# EAGLE design SmartRock_EC (EAGLE 9.5.1)
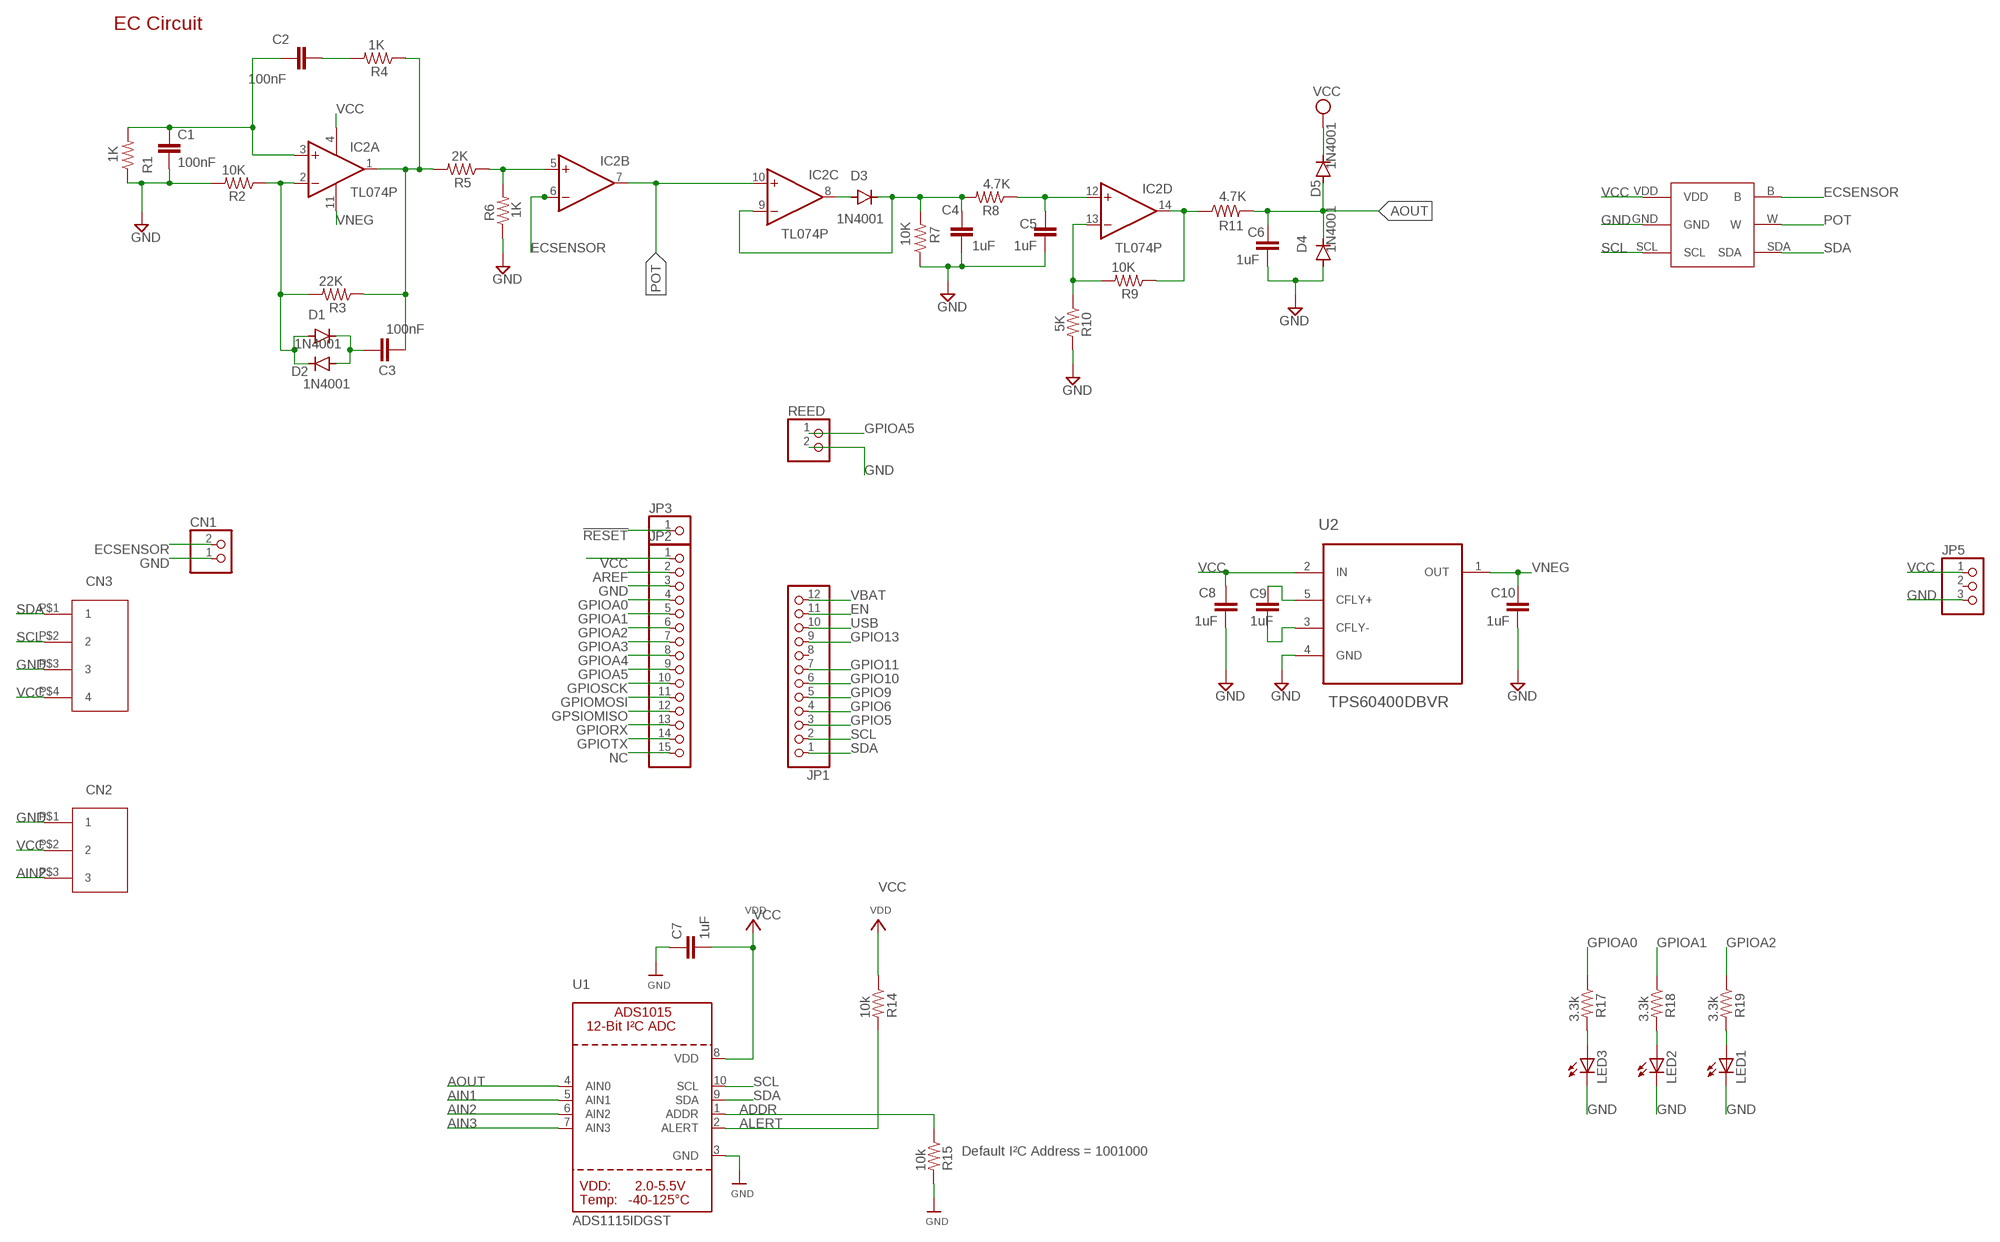
[diagram p0: schematic, sheet 1]

## Parts
C1  100nF  C-EUC1206  [C1206]
C2  100nF  C-EUC1206  [C1206]
C3  100nF  C-EUC1206  [C1206]
C4  1uF  C-EUC1206  [C1206]
C5  1uF  C-EUC1206  [C1206]
C6  1uF  C-EUC1206  [C1206]
C7  1uF  C-EUC1206  [C1206]
C8  1uF  C-EUC1206  [C1206]
C9  1uF  C-EUC1206  [C1206]
C10  1uF  C-EUC1206  [C1206]
CN1  JST_2PIN-THM  [JST-PH-2-THM]
D1  1N4001  DIODE-D-5  [D-5]
D2  1N4001  DIODE-D-5  [D-5]
D3  1N4001  DIODE-D-5  [D-5]
D4  1N4001  DIODE-D-5  [D-5]
D5  1N4001  DIODE-D-5  [D-5]
IC2  TL074P  [DIL14]
JP1  PINHD-1X12-CB  [1X12-CB]
JP2  PINHD-1X15-CB  [1X15-CB]
JP3  PINHD-1X1CB  [1X01-CLEANBIG]
JP5  PINHD-1X3CB  [1X03-CLEANBIG]
LED1  LEDSMT1206  [1206]
LED2  LEDSMT1206  [1206]
LED3  LEDSMT1206  [1206]
R1  1K  R-US_R1206  [R1206]
R2  10K  R-US_R1206  [R1206]
R3  22K  R-US_R1206  [R1206]
R4  1K  R-US_R1206  [R1206]
R5  2K  R-US_R1206  [R1206]
R6  1K  R-US_R1206  [R1206]
R7  10K  R-US_R1206  [R1206]
R8  4.7K  R-US_R1206  [R1206]
R9  10K  R-US_R1206  [R1206]
R10  5K  R-US_R1206  [R1206]
R11  4.7K  R-US_R1206  [R1206]
R14  10k  R-US_R1206  [R1206]
R15  10k  R-US_R1206  [R1206]
R17  3.3k  R-US_R1206  [R1206]
R18  3.3k  R-US_R1206  [R1206]
R19  3.3k  R-US_R1206  [R1206]
REED  PINHD-1X2  [1X02]
U1  ADS1115IDGST  ADC_ADS1015  [MSOP10]
U2  TPS60400DBVR  [SOT95P280X145-5N]
U$1  AD5246  [AD5246]
U$7  JST_4PIN_2MM  [JST_4PIN_2MM]
U$9  JST_3PIN_2MM  [JST_3PIN_2MM]

## Nets
!RESET: JP3.1
ADDR: R15.1 U1.1(ADDR)
AIN1: U1.5(AIN1)
AIN2: U1.6(AIN2) U$9.P$3
AIN3: U1.7(AIN3)
ALERT: R14.2 U1.2(ALERT)
AOUT: C6.2 D4.C D5.A R11.2 U1.4(AIN0)
AREF: JP2.2
ECSENSOR: CN1.2 IC2.6(B:-IN) U$1.B
EN: JP1.11
GND: C1.2 C4.1 C5.1 C6.1 C7.1 C8.1 C10.1 CN1.1 D4.A JP2.3 JP5.3 LED1.C LED2.C LED3.C R1.1 R2.2 R6.1 R7.1 R10.2 R15.2 REED.2 U1.3(GND) U2.4(GND) U$1.GND U$7.P$3 U$9.P$1
GPIO5: JP1.3
GPIO6: JP1.4
GPIO9: JP1.5
GPIO10: JP1.6
GPIO11: JP1.7
GPIO13: JP1.9
GPIOA0: JP2.4 R17.1
GPIOA1: JP2.5 R18.1
GPIOA2: JP2.6 R19.1
GPIOA3: JP2.7
GPIOA4: JP2.8
GPIOA5: JP2.9 REED.1
GPIOMOSI: JP2.11
GPIORX: JP2.13
GPIOSCK: JP2.10
GPIOTX: JP2.14
GPSIOMISO: JP2.12
N$1: C1.1 C2.1 IC2.3(A:+IN) R1.2
N$2: C2.2 R4.2
N$3: C3.2 IC2.1(A:OUT) R3.1 R4.1 R5.2
N$4: D1.A D2.C IC2.2(A:-IN) R2.1 R3.2
N$5: IC2.5(B:+IN) R5.1 R6.2
N$9: C3.1 D1.C D2.A
N$12: C4.2 D3.C IC2.9(C:-IN) R7.2 R8.2
N$13: D3.A IC2.8(C:OUT)
N$15: C5.2 IC2.12(D:+IN) R8.1
N$16: IC2.13(D:-IN) R9.2 R10.1
N$18: IC2.14(D:OUT) R9.1 R11.1
N$20: LED3.A R17.2
N$21: LED2.A R18.2
N$22: LED1.A R19.2
N$27: C9.2 U2.5(CFLY+)
N$28: C9.1 U2.3(CFLY-)
NC: JP2.15
POT: IC2.7(B:OUT) IC2.10(C:+IN) U$1.W
SCL: JP1.2 U1.10(SCL) U$1.SCL U$7.P$2
SDA: JP1.1 U1.9(SDA) U$1.SDA U$7.P$1
USB: JP1.10
VBAT: JP1.12
VCC: C7.2 C8.2 D5.C IC2.4(P:V+) JP2.1 JP5.1 R14.1 U1.8(VDD) U2.2(IN) U$1.VDD U$7.P$4 U$9.P$2 ; supply symbol labelled VDD
VNEG: C10.2 IC2.11(P:V-) U2.1(OUT)
Unconnected: JP1.8 JP5.2

## Notes on the sheet
- EC Circuit
- CN3
- CN2
- Default I²C Address = 1001000

## Library data of the parts
C1-C10 = rcl:C-EU: CAPACITOR, European symbol; SPICEPREFIX: C
CN1 = adafruit:JST_2PIN: JST 2-Pin Connectors of various flavors SMT-RA (S2B-PH-SM4) 4UConnector #17311 SMT (B2B-PH-SM4) THM-RA (S2B-PH) THM (B2B-PH)
D1-D5 = diode:DIODE-: DIODE
IC2 = linear:TL074: OP AMP
JP1 = adafruit:PINHD-1X12: PIN HEADER
JP2 = adafruit:PINHD-1X15: PIN HEADER
JP3 = adafruit:PINHD-1X1: Pin header 1x1 for 0.1" spacing With round pins
JP5 = adafruit:PINHD-1X3: PIN HEADER
LED1-LED3 = adafruit:LED: LED OSRAM: - CHIPLED LG R971, LG N971, LY N971, LG Q971, LY Q971, LO R971, LY R971 LH N974, LH R974 LS Q976, LO Q976, LY Q976 LO Q996 - Hyper CHIPLED LW Q18S LB Q993, LB Q99A, LB R99A - SideLED LS A670, LO A670, LY A670, LG A670, LP A670 LB A673, LV A673, LT A673, LW A673 LH A674 LY A675 LS A676, LA A676, LO A676, LY A676, LW A676 LS A679, LY A679, LG A679 - Hyper Micro SIDELED® LS Y876, LA Y876, LO Y876, LY Y876 LT Y87S - SmartLED LW L88C, LW L88S LB L89C, LB L89S, LG L890 LS L89K, LO L89K, LY L89K LS L896, LA L896, LO L896, LY L896 - TOPLED LS T670, LO T670, LY T670, LG T670, LP T670 LSG T670, LSP T670, LSY T670, LOP T670, LYG T670 LG T671, LOG T671, LSG T671 LB T673, LV T673, LT T673, LW T673 LH T674 LS T676, LA T676, LO T676, LY T676, LB T676, LH T676, LSB T676, LW T676 LB T67C, LV T67C, LT T67C, LS T67K, LO T67K, LY T67K, LW E67C LS E67B, LA E67B, LO E67B, LY E67B, LB E67C, LV E67C, LT E67C LW T67C LS T679, LY T679, LG T679 LS T770, LO T770, LY T770, LG T770, LP T770 LB T773, LV T773, LT T773, LW T773 LH T774 LS E675, LA E675, LY E675, LS T675 LS T776, LA T776, LO T776, LY T776, LB T776 LHGB T686 LT T68C, LB T68C - Hyper Mini TOPLED® LB M676 - Mini TOPLED Santana® LG M470 LS M47K, LO M47K, LY M47K Source: http://www.osram.convergy.de/
R1-R11 R14 R15 R17-R19 = rcl:R-US_: RESISTOR, American symbol; SPICEPREFIX: R
REED = pinhead:PINHD-1X2: PIN HEADER
U1 = microbuilder:ADC_ADS1015: ADS1015 - 12-bit 4-Channel I2C ADC with Internal PGA VDD: 2.0-5.5V Sampling Rate: 3.3ksps Gain Settings: 2/3, 1, 2, 4, 8, 16 I2C Address: ADDR low = 1001000x, ADDR high = 1001001x Internal Comparator The ADS1015 includes an internal comparator that can be set to output a high-level on ALERT when the conversion results exceeeds a pre-defined upper level, and will deassert itself when the level falls below a pre-defined lower threshold level. It can also be set to windowed mode where the ALERT pin will be asserted if the data exceeds the upper threshold or falls below the lower threshold.
U2 = TPS60400DBVR:TPS60400DBVR: Unregulated 60mA charge pump Voltage Inverter; AVAILABILITY: Unavailable; DESCRIPTION: 60mA Charge Pump Voltage Inverter with Variable Switching Frequency 5-SOT-23 -40 to 85; MF: Texas Instruments; MP: TPS60400DBVR; PACKAGE: SOT-23-5 Texas Instruments; PRICE: None
U$1 = AD5246:AD5246
U$7 = JSTconnector:JST_4PIN_2MM
U$9 = JSTconnector:JST_3PIN_2MM

## Net classes
0 default: width 0.305 mm

## Board
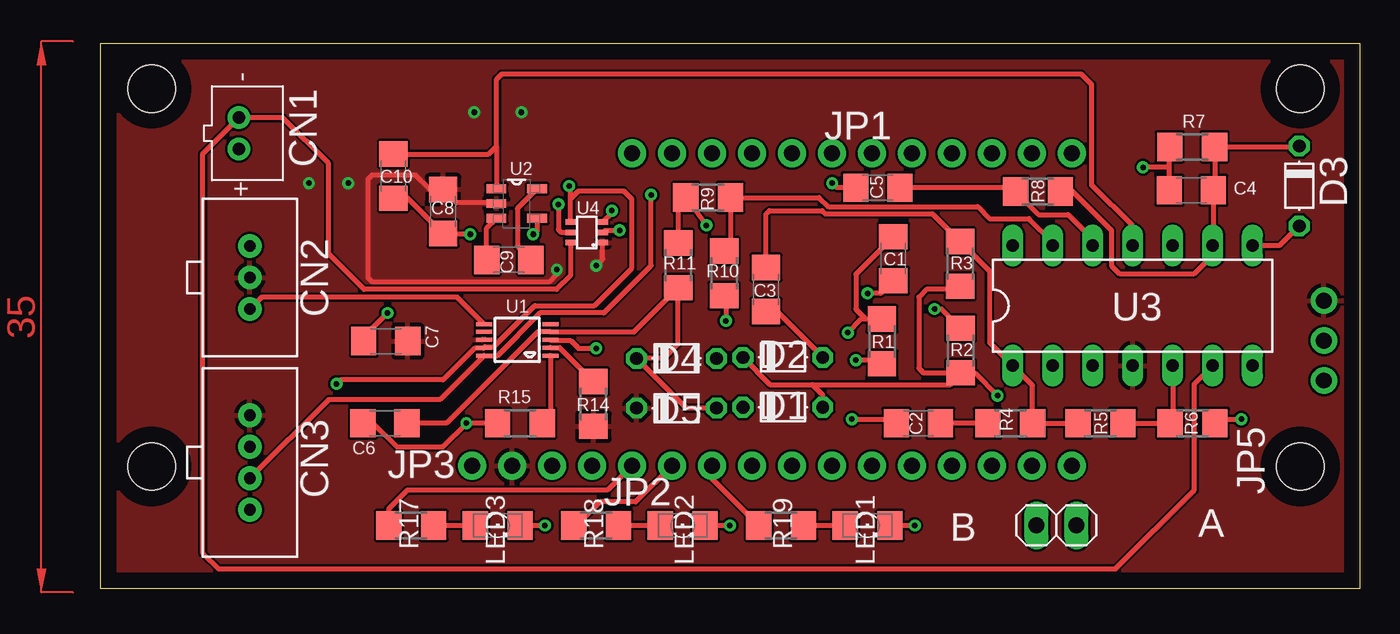
[diagram p1: board, top side]
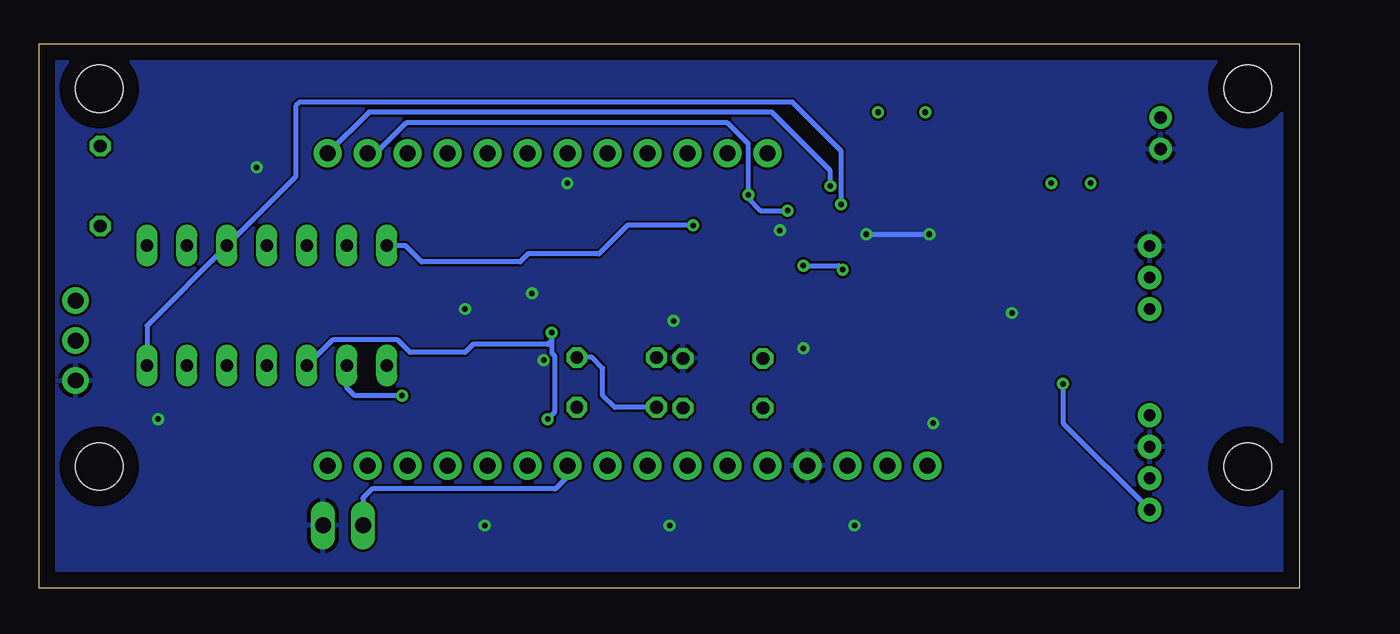
[diagram p2: board, bottom side, seen from below]

Size 80.05 x 34.57 mm. Coordinates in mm from the lower left corner, seen from the top.
Outline: 0,0 80.05,0 80.05,34.57 0,34.57 0,0
Copper layers (1*16): Top 0.035mm / dielectric 1.5mm / Bottom 0.035mm
Design rules "default": minimum track width 6mil, minimum drill 0.35mm, track to track 6mil, track to pad 6mil, pad to pad 6mil, via to via 6mil, smd to smd 6mil, copper to edge 40mil, drill to drill 6mil, minimum pad ring 10mil, minimum via ring 8mil, stop-mask expansion 4mil, vias tented up to drill 0mil, thermal gap 10mil
Holes 3 mm at 3.25,31.73 3.25,7.73 76.25,31.73 76.25,7.73

### Footprints (pad centres in the part's own frame; a part is rotated, then mirrored left to right if it is on the bottom)
C1206 = smd 1.6 x 1.8: 1 -1.4,0; 2 1.4,0
JST-PH-2-THM = drill 0.8 pad 1.422: 1 1,0; 2 -1,0
D-5 = drill 0.813 octagon: A 2.54,0; C -2.54,0
DIL14 = drill 0.813 long: 1 -7.62,-3.81; 2 -5.08,-3.81; 3 -2.54,-3.81; 4 0,-3.81; 5 2.54,-3.81; 6 5.08,-3.81; 7 7.62,-3.81; 8 7.62,3.81; 9 5.08,3.81; 10 2.54,3.81; 11 0,3.81; 12 -2.54,3.81; 13 -5.08,3.81; 14 -7.62,3.81
1X12-CB = drill 1.016 pad 1.778: 1 -13.97,0; 2 -11.43,0; 3 -8.89,0; 4 -6.35,0; 5 -3.81,0; 6 -1.27,0; 7 1.27,0; 8 3.81,0; 9 6.35,0; 10 8.89,0; 11 11.43,0; 12 13.97,0
1X15-CB = drill 1.016 pad 1.778: 1 -17.78,0; 2 -15.24,0; 3 -12.7,0; 4 -10.16,0; 5 -7.62,0; 6 -5.08,0; 7 -2.54,0; 8 0,0; 9 2.54,0; 10 5.08,0; 11 7.62,0; 12 10.16,0; 13 12.7,0; 14 15.24,0; 15 17.78,0
1X01-CLEANBIG = drill 1.016 pad 1.778: 1 0,0
1X03-CLEANBIG = drill 1.016 pad 1.676: 1 -2.54,0; 2 0,0; 3 2.54,0
1206 = smd 1.6 x 1.803: A -1.422,0; C 1.422,0
R1206 = smd 1.6 x 1.803: 1 -1.422,0; 2 1.422,0
1X02 = drill 1.016 long: 1 -1.27,0; 2 1.27,0
MSOP10 = smd 0.25 x 1: 1 -1,-2.113; 2 -0.5,-2.113; 3 0,-2.113; 4 0.5,-2.113; 5 1,-2.113; 6 1,2.113; 7 0.5,2.113; 8 0,2.113; 9 -0.5,2.113; 10 -1,2.113
SOT95P280X145-5N = smd 1.27 x 0.559: 1 -1.295,0.94; 2 -1.295,0; 3 -1.295,-0.94; 4 1.295,-0.94; 5 1.295,0.94
AD5246 = smd 0.35 x 0.65: B -0.65,0.9; GND 0,-1.15; SCL 0.65,-1.15; SDA 0.65,0.9; VDD -0.65,-1.15; W 0,0.9
JST_4PIN_2MM = drill 0.75 pad 1.5: P$1 0,0; P$2 -2,0; P$3 -4,0; P$4 -6,0
JST_3PIN_2MM = drill 0.75 pad 1.5: P$1 -2,0; P$2 0,0; P$3 2,0

### Placement (x,y rotation side)
C1  50.38,20.93 270 top
C2  51.98,10.48 0 top
C3  42.3,18.97 90 top
C4  69.32,25.27 0 top
C5  49.4,25.43 0 top
C6  18.07,10.48 0 top
C7  18.13,15.69 0 top
C8  21.78,23.92 90 top
C9  25.95,20.85 0 top
C10  18.62,26.17 90 top
CN1  8.79,28.89 270 top
D1  43.36,11.5 0 top
D2  43.36,14.65 0 top
D3  76.17,25.55 270 top
D4  36.61,14.59 0 top
D5  36.61,11.44 0 top
IC2  65.59,17.95 0 top
JP1  47.75,27.61 180 top
JP2  43.94,7.79 0 top
JP3  23.62,7.79 0 top
JP5  77.75,15.73 270 top
LED1  48.75,3.98 0 top
LED2  37,3.98 0 top
LED3  25.25,3.98 0 top
R1  49.66,15.68 90 top
R2  54.67,15.09 90 top
R3  54.63,20.59 270 top
R4  57.81,10.48 180 top
R5  63.55,10.48 180 top
R6  69.39,10.47 180 top
R7  69.38,28.03 0 top
R8  59.58,25.18 0 top
R9  38.61,24.81 0 top
R10  39.63,19.99 270 top
R11  36.72,20.5 270 top
R14  31.33,11.7 90 top
R15  26.65,10.48 180 top
R17  19.75,3.98 0 top
R18  31.5,3.98 0 top
R19  43.25,3.98 0 top
REED  60.75,3.98 0 top
U1  26.49,15.78 90 top
U2  26.45,24.43 0 top
U$1  30.77,22.6 90 top
U$7  9.5,4.98 270 top
U$9  9.5,19.73 270 top

### Tracks (layer width: path | path; a pad name or v marks a point on that pad's centre or on a via)
ADDR
  Top 0.305: U1.1 28.6,11.09 R15.1
AIN2
  Top 0.305: U$9.P$3 10.25,18.48 22.67,18.48 U1.6
ALERT
  Top 0.305: U1.2 29.18,15.28 R14.2
AOUT
  Top 0.305: D5.A 37.23,11.44 D4.C 35.8,14.59 36.69,15.48 36.69,19.04 R11.2 33.92,16.28 U1.4 27.8,16.28 22,10.48 C6.2
ECSENSOR
  Top 0.305: U$1.B 29.87,19.85 29,18.98 16.75,18.98 14.5,21.23 14.5,26.98 11.59,29.89 CN1.2 6.5,27.61 6.5,2.23 7.5,1.23 64.5,1.23 69.5,6.23 69.5,12.97 IC2.6
GND  (via drill 0.35)
  Top 0.305: C10.1 19.53,24.77 C8.1 21.82,22.48 v23.5,22.48 | U2.4 27.75,22.73 v27.5,22.48 | U1.3 28.64,15.73 29.87,15.73 30.37,15.23 v31.5,15.23 | R10.2 39.75,18.45 v39.75,16.98 | C1.2 49.58,18.73 v48.75,18.73 | C5.1 46.8,25.43 v46.5,25.73 | R1.1 49.44,14.48 v48,14.48 | R6.1 71.07,10.73 v72.5,10.73 | R2.2 53.45,17.73 v53,17.73 | U$1.GND 32.05,22.73 v33,22.73 | LED1.C v51.75,3.98 | LED2.C v40,3.98 | LED3.C v28.25,3.98 | R15.2 v23.25,10.48 | v23.25,10.48 | C6.1 17.34,10.48 18.84,8.98 21.76,8.98 v23.25,10.48 | C4.1 67.92,26.73 | 67.92,26.73 67.92,27.99 R7.1 | 67.92,26.73 v66.25,26.73 | 16.75,15.71 C7.1 16.73,15.96 v18.25,17.48
  Bottom 0.305: v27.5,22.48 v23.5,22.48
  pour Bottom: 0,34.48 80,34.48 80,-0.02 0,-0.02
GPIOA0
  Top 0.305: JP2.4 32.22,6.23 19.5,6.23 18.33,5.06 R17.1
GPIOA1
  Top 0.305: R18.1 30.08,3.81 31.75,5.48 34.01,5.48 JP2.5
GPIOA2
  Top 0.305: R19.1 38.86,6.95 JP2.6
GPIOA5
  Bottom 0.305: REED.1 59.48,5.73 58.9,6.31 47.25,6.31 46.48,7.08 JP2.9
N$1  (via drill 0.35)
  Top 0.305: C1.1 48,19.95 48,17.73 48.63,17.1 | 48.63,17.1 R1.2 | v47.5,16.23 48.37,17.1 48.63,17.1 | v47.75,10.73 50.33,10.73 C2.1
  Bottom 0.305: IC2.3 61.43,15.77 57.29,15.77 56.5,14.98 53,14.98 52.5,15.48 47.75,15.48 47.5,15.73 | v47.5,16.23 47.5,15.73 | 47.5,15.73 47.5,14.95 47.32,14.76 47.32,11.16 v47.75,10.73
N$2
  Top 0.305: R4.2 C2.2
N$3
  Top 0.305: C3.2 42.3,23.78 42.5,23.98 45.85,23.98 46.06,23.77 52.88,23.77 R3.1 56.5,20.15 56.5,15.61 IC2.1 59.23,12.88 R4.1 R5.2
N$4  (via drill 0.35)
  Top 0.305: R3.2 54.44,18.98 52.5,18.98 52,18.48 52,13.98 52.31,13.67 R2.1 54.75,13.67 | 54.75,13.67 55.56,13.67 v57,12.23 | 54.75,13.67 54,12.92 45.25,12.92 | D2.C 42.55,12.92 45.25,12.92 | D1.A 45.9,12.27 45.25,12.92
  Bottom 0.305: v57,12.23 60,12.23 60.51,12.74 IC2.2
N$5
  Top 0.305: R5.1 R6.2 68.13,10.63 IC2.5
N$9
  Top 0.305: C3.1 42.98,17.57 D2.A
  Bottom 0.305: D1.C 43.48,11.5 43.5,11.48 44.25,12.23 44.25,13.98 44.92,14.65 D2.A
N$12
  Top 0.305: IC2.9 70.67,21.48 | 70.67,21.48 70.67,21.15 69.5,19.98 64.75,19.98 64.25,20.48 64.25,22.73 61.8,25.18 R8.2 | 70.67,21.48 70.72,21.53 C4.2 70.8,25.36 R7.2 76.12,28.03 D3.C
N$13
  Top 0.305: D3.A 74.92,21.76 IC2.8
N$15
  Top 0.305: C5.2 57.91,25.43 R8.1 59.61,23.73 61.5,23.73 63.05,22.18 IC2.12
N$16
  Top 0.305: R10.1 40.04,21.82 R9.2 45.67,24.81 46.25,24.23 55.75,24.23 56.5,23.48 59,23.48 60.51,21.97 IC2.13
N$18  (via drill 0.35)
  Top 0.305: R11.1 36.72,24.34 R9.1 37.23,24.81 v38.51,23.05
  Bottom 0.305: IC2.14 56.78,21.76 55.75,20.73 49.5,20.73 49,21.23 44.5,21.23 42.68,23.05 v38.51,23.05
N$20
  Top 0.305: R17.2 LED3.A
N$21
  Top 0.305: R18.2 LED2.A
N$22
  Top 0.305: R19.2 LED1.A
N$27
  Top 0.305: U2.5 26.5,24.12 26.5,21.71 C9.2
N$28
  Top 0.305: C9.1 24.55,22.88 U2.3
POT  (via drill 0.35)
  Top 0.305: v29.1,24.38 29.1,22.78 29.28,22.6 U$1.W
  Bottom 0.305: v29.1,24.38 29.1,27.78 32.2,30.88 63.5,30.88 63.75,30.63 63.75,26.14 IC2.10 73.21,16.68 IC2.7
SCL  (via drill 0.35)
  Top 0.305: v32.5,23.98 32.5,23.82 U$1.SCL | v35,24.98 35,20.48 32,17.48 27.94,17.48 25.23,14.78 U1.10 21.58,11.98 14.5,11.98 U$7.P$2
  Bottom 0.305: v32.5,23.98 34.25,23.98 35,24.73 v35,24.98 35,28.23 36.32,29.55 56.74,29.55 58.68,27.61 JP1.2
SDA  (via drill 0.35)
  Top 0.305: U$1.SDA 29.87,24.73 | 29.87,24.73 30.37,25.23 33.25,25.23 33.75,24.73 33.78,24.73 33.78,20.33 31.4,17.95 27.6,17.95 25,15.34 24.44,15.34 U1.9 24.33,15.23 23.77,15.23 21.77,13.23 15.25,13.23 v15,12.98 | 29.87,24.73 29.87,25.46 v29.78,25.55
  Bottom 0.305: v29.78,25.55 29.78,26.51 33.5,30.23 59.1,30.23 JP1.1 | v15,12.98 15,10.48 U$7.P$1
VCC  (via drill 0.35)
  Top 0.305: U2.2 25.11,24.48 22.62,24.48 C8.2 20.91,25.32 20,26.23 17.25,26.23 17,25.98 17,19.73 17.29,19.44 28.5,19.44 29,19.94 v29,20.23 | v31.5,20.48 31.92,20.9 U$1.VDD
  Bottom 0.305: v29,20.23 29.25,20.48 v31.5,20.48
  other vias: 13.25,25.73 15.75,25.73 23.75,30.23 26.75,30.23
  pour Top: 0,34.48 80,34.48 80,-0.02 0,-0.02
VNEG
  Top 0.305: 25.16,28.08 U2.1 | 25.16,28.08 24.65,27.57 C10.2 | IC2.11 65.59,23.01 63,25.6 63,31.98 62.33,32.65 25.5,32.65 25.16,32.31 25.16,28.08
(copper drawn outside any net)
  shapes: Top area x1

### Text on the board
tNames: CN1 | R7 | JP1 | C10 | U2 | C5 | R8 | C4 | C8 | U4 | R9 | D3 | C1 | C9 | R11 | R10 | R3 | C3 | CN2 | U1 | U3 | C7 | D4 | D2 | R1 | R2 | D1 | R15 | R14 | D5 | C2 | R4 | R5 | R6 | C6 | JP3 | CN3 | JP2 | JP5 | A | B